# EAGLE design MurataBLE_FS (EAGLE 7.5.0)
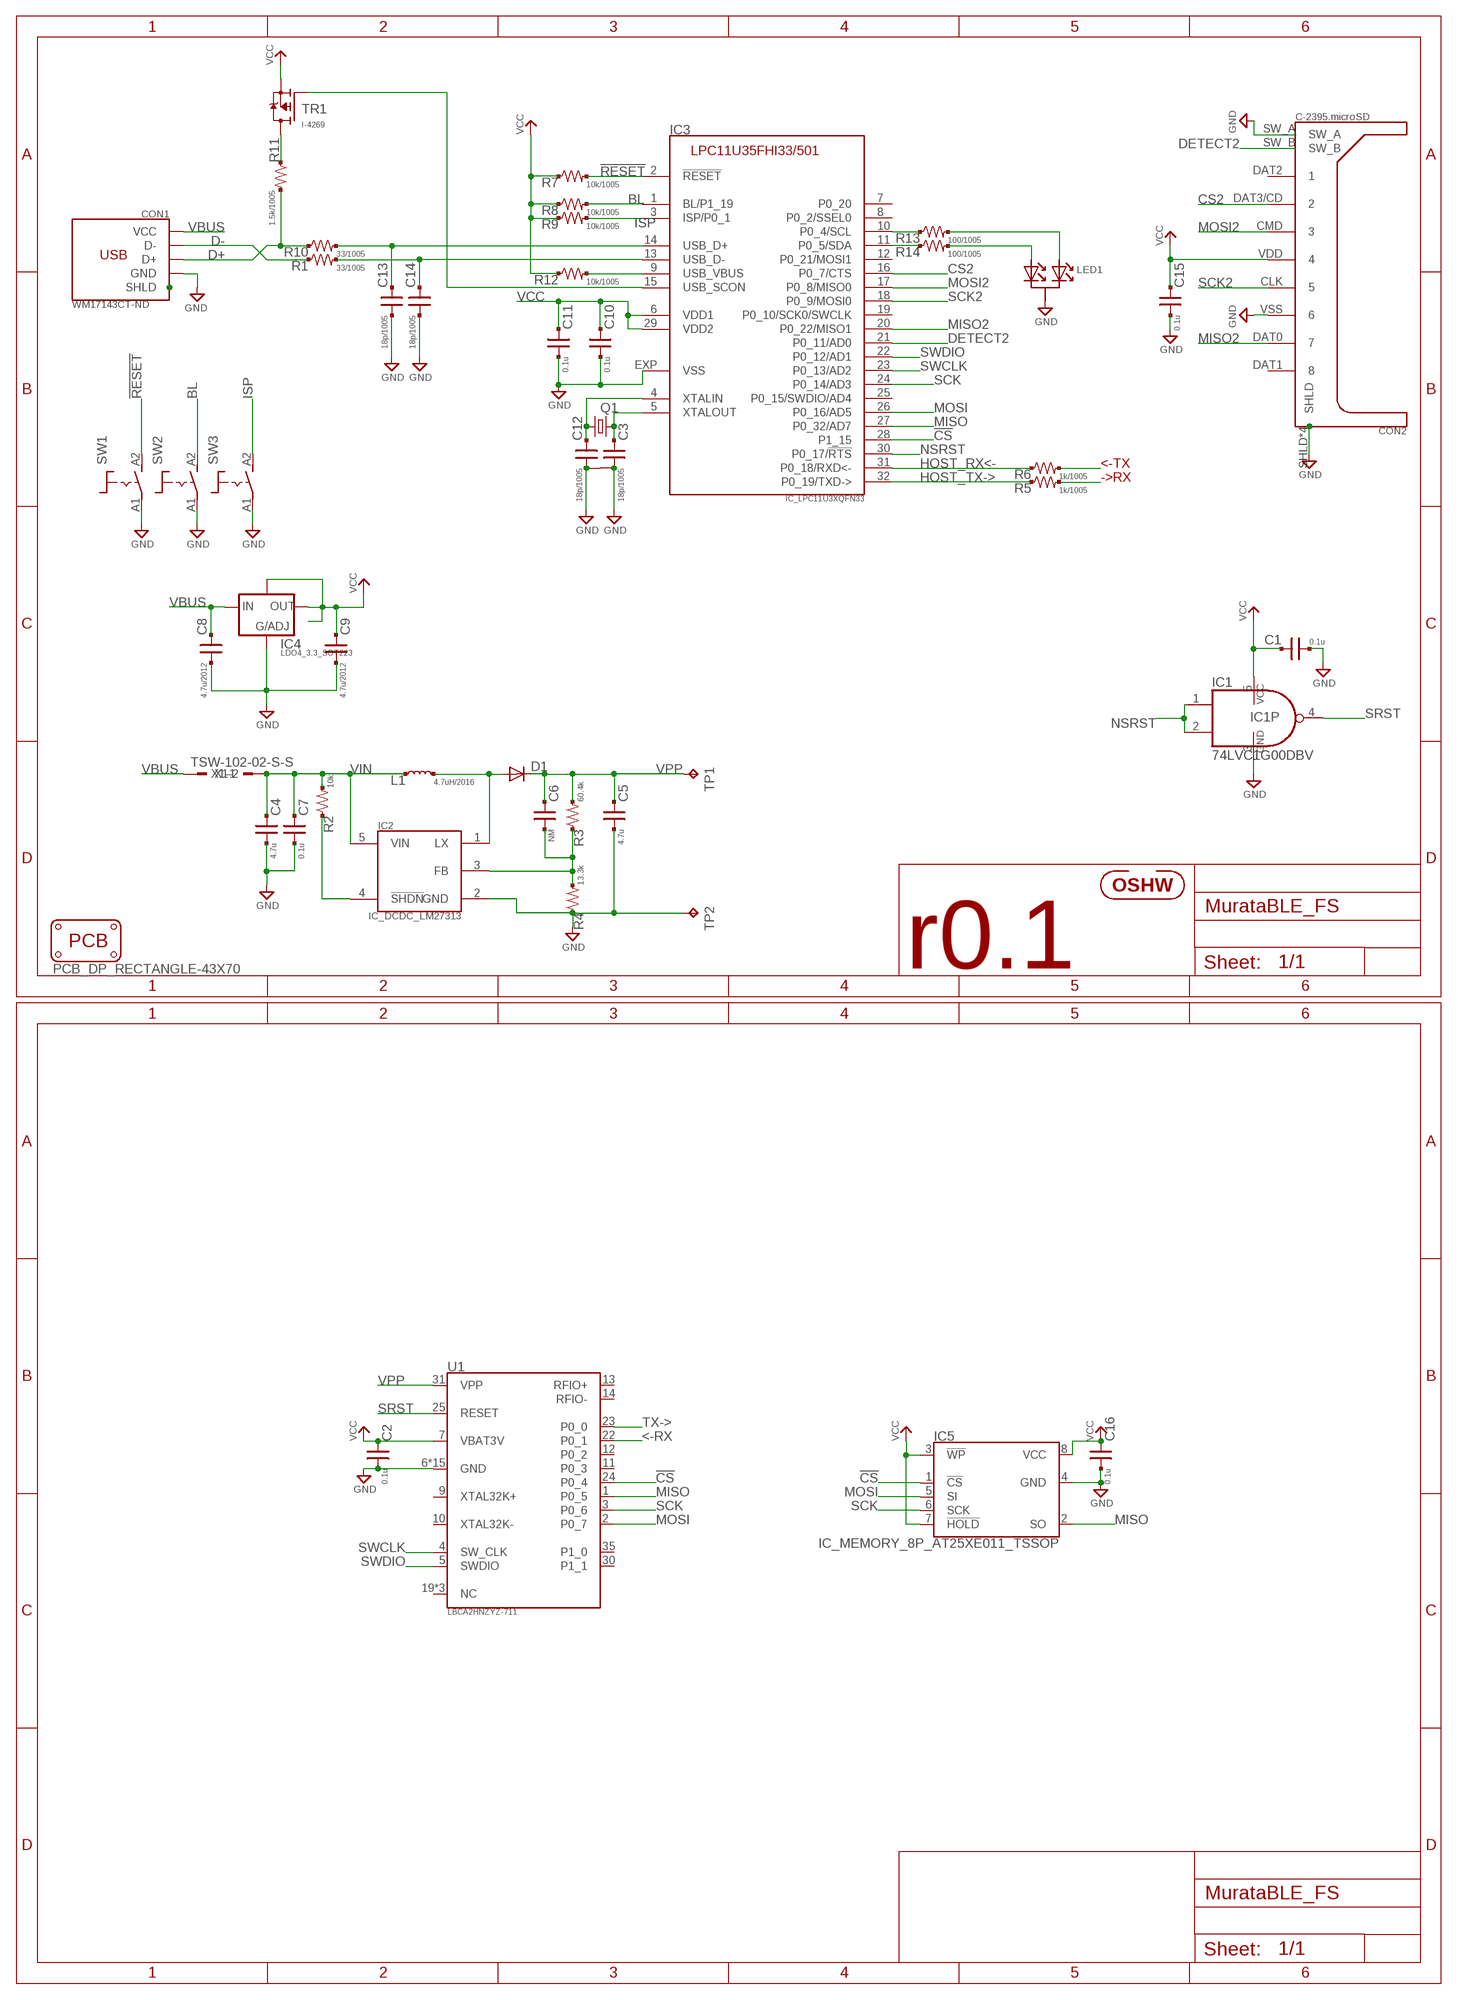
[diagram p0: schematic, sheet 1]

## Parts
C1  0.1u  C_SMD_0.1U_1005  [C0402]
C2  0.1u  C_SMD_0.1U_1005  [C0402]
C3  18p/1005  C_SMD_18P_1005  [C0402]
C4  4.7u  C_SMD_4.7U_2012  [CR_2125]
C5  4.7u  C_SMD_4.7U_2012  [CR_2125]
C6  NM  C_SMD__1608  [CR_1608]
C7  0.1u  C_SMD_0.1U_1608  [CR_1608]
C8  4.7u/2012  C_SMD_4.7U_2012  [CR_2125]
C9  4.7u/2012  C_SMD_4.7U_2012  [CR_2125]
C10  0.1u  C_SMD_0.1U_1005  [C0402]
C11  0.1u  C_SMD_0.1U_1005  [C0402]
C12  18p/1005  C_SMD_18P_1005  [C0402]
C13  18p/1005  C_SMD_18P_1005  [C0402]
C14  18p/1005  C_SMD_18P_1005  [C0402]
C15  0.1u  C_SMD_0.1U_1608  [CR_1608]
C16  0.1u  C_SMD_0.1U_1005  [C0402]
CON1  WM17143CT-ND  CON_USB_UB  [CON_USB_47589-0001MOLEX]
CON2  C-2395.microSD  CON_MICROSD_C2395  [CON_MICROSD_C2395]
D1  DIODE_SMALL  [DIODE_2125]
IC1  74LVC1G00DBV  [SOT23-5]
IC2  IC_DCDC_LM27313  [IC_05_0.95_50MIL]
IC3  IC_LPC11U3XQFN33  [HVQFN33]
IC4  LDO4_3.3_SOT223  [IC_SOT223]
IC5  IC_MEMORY_8P_AT25XE011_TSSOP  [IC_08_0.65_160MIL]
L1  4.7uH/2016  INDUCTOR_4.7U_2016  [L_2016]
LED1  LED_1SEG_A2K1  [SOT95P300X140-3N]
PCB1  PCB_DP_RECTANGLE-43X70  [DP7043_V1]
Q1  CRYSTAL4_12M_3225  [CLOCK_3225]
R1  33/1005  R_US_33R_1005  [C0402]
R2  10k  R_US_10K_1608  [R_1608_PADPAD]
R3  60.4k  R_US_60.4K_1608  [R_1608_PADPAD]
R4  13.3k  R_US_13.3K_1608  [R_1608_PADPAD]
R5  1k/1005  R_US_1.0K_1005  [C0402]
R6  1k/1005  R_US_1.0K_1005  [C0402]
R7  10k/1005  R_US_10K_1005  [C0402]
R8  10k/1005  R_US_10K_1005  [C0402]
R9  10k/1005  R_US_10K_1005  [C0402]
R10  33/1005  R_US_33R_1005  [C0402]
R11  1.5k/1005  R_US_1.5K_1005  [C0402]
R12  10k/1005  R_US_10K_1005  [C0402]
R13  100/1005  R_US_100R_1005  [C0402]
R14  100/1005  R_US_100R_1005  [C0402]
SW1  TACTSW2_BK_P807X  [SW_TACTSW_P8073]
SW2  TACTSW2_WH_P807X  [SW_TACTSW_P8073]
SW3  TACTSW2_BK_P807X  [SW_TACTSW_P8073]
TP1  P7592  TPPAD1-13  [P1-13]
TP2  P7591  TPPAD1-13  [P1-13]
TR1  I-4269  TR_PMOS_GDS_SOT23  [SOT95P300X140-3N]
U1  LBCA2HNZYZ-711  [IC_MURATA_LBCA2HNZYZ-711]
U$1  ICON_OSHW  [ICON_OSHW]
X1  TSW-102-02-S-S  [TSW-102-02-S-S]

## Nets
!CS!: IC3.28(P1_15) IC5.1(!CS) U1.24(P0_4)
!RESET!: IC3.2(!RESET!) R7.2 SW1.A2(S)
<-RX: R5.2 U1.22(P0_1)
BL: IC3.1(BL/P1_19) R8.2 SW2.A2(S)
CS2: CON2.DAT3/CD IC3.16(P0_7/CTS)
D+: CON1.3(D+) R10.1 R11.2
D-: CON1.2(D-) R1.1
DETECT2: CON2.SW_B IC3.21(P0_11/AD0)
GND: C1.2 C2.2 C3.2 C4.2 C5.2 C7.2 C8.2 C9.2 C10.2 C11.2 C12.2 C13.2 C14.2 C15.2 C16.2 CON1.5(GND) CON2.SHLD CON2.SHLD@2(SHLD) CON2.SHLD@3(SHLD) CON2.SHLD@4(SHLD) CON2.SW_A CON2.VSS IC1.3(GND) IC2.2(GND) IC3.EXP(VSS) IC4.1(ADJ) IC5.4(GND) LED1.3(K1) Q1.2 Q1.4 R4.1 SW1.A1(P) SW2.A1(P) SW3.A1(P) TP2.TP U1.6(GND) U1.8(GND) U1.15(GND) U1.16(GND) U1.17(GND) U1.18(GND) U1.20(GND) U1.21(GND) U1.26(GND) U1.27(GND) U1.28(GND) U1.29(GND) U1.32(GND) U1.33(GND) U1.34(GND)
HOST_RX<-: IC3.31(P0_18/RXD<-) R6.1
HOST_TX->: IC3.32(P0_19/TXD->) R5.1
ISP: IC3.3(ISP/P0_1) R9.2 SW3.A2(S)
MISO: IC3.27(P0_32/AD7) IC5.2(SO) U1.1(P0_5)
MISO2: CON2.DAT0 IC3.20(P0_22/MISO1)
MOSI: IC3.26(P0_16/AD5) IC5.5(SI) U1.2(P0_7)
MOSI2: CON2.CMD IC3.17(P0_8/MISO0)
N$2: R11.1 TR1.3(D)
N$3: IC3.10(P0_4/SCL) R13.1
N$4: CON1.SHD$1(SHLD) CON1.SHD$2(SHLD) CON1.SHD$3(SHLD) CON1.SHD$4(SHLD) CON1.SHD$5(SHLD) CON1.SHD$6(SHLD) CON1.SHD$7(SHLD) CON1.SHD(SHLD)
N$5: C12.1 IC3.4(XTALIN) Q1.1
N$6: IC3.11(P0_5/SDA) R14.1
N$7: D1.A IC2.1(LX) L1.2
N$8: IC2.4(!SHDN!) R2.1
N$9: LED1.2(A2) R13.2
N$10: C6.2 IC2.3(FB) R3.1 R4.2
N$11: C3.1 IC3.5(XTALOUT) Q1.3
N$12: IC3.15(USB_SCON) TR1.1(G)
N$13: IC3.9(USB_VBUS) R12.2
N$14: LED1.1(A1) R14.2
N$20: C13.1 IC3.14(USB_D+) R10.2
N$24: C14.1 IC3.13(USB_D-) R1.2
NSRST: IC1.1(I0) IC1.2(I1) IC3.30(P0_17/!RTS!)
SCK: IC3.24(P0_14/AD3) IC5.6(SCK) U1.3(P0_6)
SCK2: CON2.CLK IC3.18(P0_9/MOSI0)
SRST: IC1.4(O) U1.25(RESET)
SWCLK: IC3.23(P0_13/AD2) U1.4(SW_CLK)
SWDIO: IC3.22(P0_12/AD1) U1.5(SWDIO)
TX->: R6.2 U1.23(P0_0)
VBUS: C8.1 CON1.1(VCC) IC4.3(IN) X1.1
VCC: C1.1 C2.1 C9.1 C10.1 C11.1 C15.1 C16.1 CON2.VDD IC1.5(VCC) IC3.6(VDD1) IC3.29(VDD2) IC4.2(OUT) IC4.4(OUT/EN/NC) IC5.3(!WP) IC5.7(!HOLD) IC5.8(VCC) R7.1 R8.1 R9.1 R12.1 TR1.2(S) U1.7(VBAT3V)
VIN: C4.1 C7.1 IC2.5(VIN) L1.1 R2.2 X1.2
VPP: C5.1 C6.1 D1.K(C) R3.2 TP1.TP U1.31(VPP)
Unconnected: CON2.DAT1 CON2.DAT2 IC3.7(P0_20) IC3.8(P0_2/SSEL0) IC3.12(P0_21/MOSI1) IC3.19(P0_10/SCK0/SWCLK) IC3.25(P0_15/SWDIO/AD4) U1.9(XTAL32K+) U1.10(XTAL32K-) U1.11(P0_3) U1.12(P0_2) U1.13(RFIO+) U1.14(RFIO-) U1.19(NC) U1.30(P1_1) U1.35(P1_0) U1.36(NC) U1.37(NC)

## Notes on the sheet
- <-TX
- ->RX
- r0.1

## Library data of the parts
C1 C2 C10 C11 C16 = mylib:C_SMD_*: SMD CAPACITOR : PAD - PAD; DIGIKEY: 490-3261-1-ND
C3 C12-C14 = mylib:C_SMD_*: SMD CAPACITOR : PAD - PAD; DIGIKEY: 490-5858-1-ND
C4 C5 C8 C9 = mylib:C_SMD_*: SMD CAPACITOR : PAD - PAD; DIGIKEY: 490-9962-1-ND
C6 = mylib:C_SMD_*: SMD CAPACITOR : PAD - PAD
C7 C15 = mylib:C_SMD_*: SMD CAPACITOR : PAD - PAD; AKIZUKI: P-05650
CON1 = mylib:CON_USB: USB B CONNECTOR; DIGIKEY: WM17143CT-ND
CON2 = mylib:CON_MICROSD: HIROSE DM3AT-SF-PEJM5 798-DM3AT-SF-PEJM5(Mouser) http://www.mouser.jp/ProductDetail/Hirose-Connector/DM3AT-SF-PEJM5/?qs=LZSZKJVF%252b2WTDKp%252bR7IYAQ%3d%3d&_cdc=0; AKIZUKI: C-02395; DIGIKEY: HR1964CT-ND; MOUSER: 798-DM3AT-SF-PEJM5
D1 = mylib:DIODE_SMALL: DIODE high speed (Philips)
IC1 = 74xx-little-us_local:74*1G00: 2-input NAND gate
IC2 = mylib:IC_DCDC_LM27313
IC3 = mylib:IC_LPC11U3XQFN33
IC4 = mylib:LDO4_*; DIGIKEY: AZ1117EH-3.3TRG1DICT-ND
IC5 = mylib:IC_MEMORY_8P_*; DIGIKEY: 1265-1184-5-ND; MOUSER: !non-stock! 988-AT25XE011-SSHN-B
L1 = mylib:INDUCTOR_; DIGIKEY: 445-7844-1-ND
LED1 = mylib:LED_1SEG_A2K1
PCB1 = dp_pcb_local:PCB_DP_RECTANGLE: Dangerous Prototypes Standard Rectangular PCB sizes
Q1 = mylib:CRYSTAL4_*; DIGIKEY: 1253-1168-1-ND
R1 R10 = mylib:R_US_*: R_US_PAD_PAD : SMD R PAD is NTH-NTH Packages : _1608 : 1.6 x 0.8 mm _2125 : 2.0 x 1.25 mm _3216 : 3.2 x 1.6 mm; DIGIKEY: P33.0LCT-ND
R2 R5 R6 = mylib:R_US_*: R_US_PAD_PAD : SMD R PAD is NTH-NTH Packages : _1608 : 1.6 x 0.8 mm _2125 : 2.0 x 1.25 mm _3216 : 3.2 x 1.6 mm
R3 = mylib:R_US_*: R_US_PAD_PAD : SMD R PAD is NTH-NTH Packages : _1608 : 1.6 x 0.8 mm _2125 : 2.0 x 1.25 mm _3216 : 3.2 x 1.6 mm; DIGIKEY: P60.4KHCT-ND
R4 = mylib:R_US_*: R_US_PAD_PAD : SMD R PAD is NTH-NTH Packages : _1608 : 1.6 x 0.8 mm _2125 : 2.0 x 1.25 mm _3216 : 3.2 x 1.6 mm; DIGIKEY: P13.3KHCT-ND
R7-R9 R12 = mylib:R_US_*: R_US_PAD_PAD : SMD R PAD is NTH-NTH Packages : _1608 : 1.6 x 0.8 mm _2125 : 2.0 x 1.25 mm _3216 : 3.2 x 1.6 mm; DIGIKEY: P10.0KLCT-ND
R11 = mylib:R_US_*: R_US_PAD_PAD : SMD R PAD is NTH-NTH Packages : _1608 : 1.6 x 0.8 mm _2125 : 2.0 x 1.25 mm _3216 : 3.2 x 1.6 mm; DIGIKEY: P1.50KLCT-ND
R13 R14 = mylib:R_US_*: R_US_PAD_PAD : SMD R PAD is NTH-NTH Packages : _1608 : 1.6 x 0.8 mm _2125 : 2.0 x 1.25 mm _3216 : 3.2 x 1.6 mm; DIGIKEY: P100LCT-ND
SW1 SW3 = mylib:TACTSW2_*; AKIZUKI: P-08073
SW2 = mylib:TACTSW2_*; AKIZUKI: P-08074
TP1 TP2 = testpad_local:TP: Test pad
TR1 = mylib:TR_PMOS_GDS
U1 = mylib:LBCA2HNZYZ-711; DIGIKEY: 490-10561-1-ND; MOUSER: 81-LBCA2HNZYZ-711
U$1 = mylib:ICON_OSHW
X1 = con-samtec.local:TSW-102-02-S-S: THROUGH-HOLE .025" SQ POST HEADER Source: Samtec TSW.pdf; OC_FARNELL: unknown; OC_NEWARK: unknown

## Board
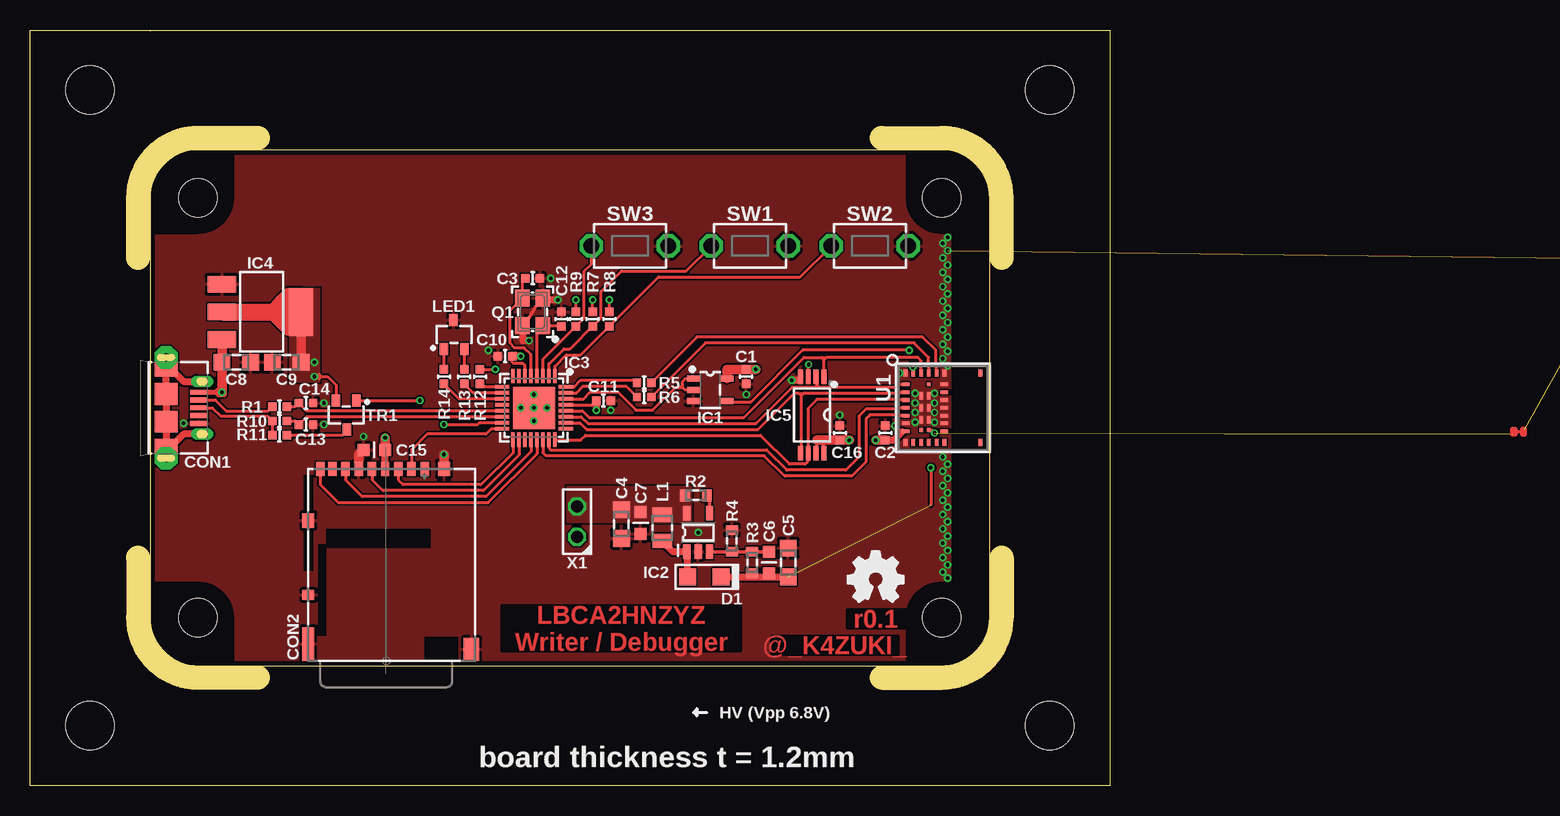
[diagram p1: board, top side]
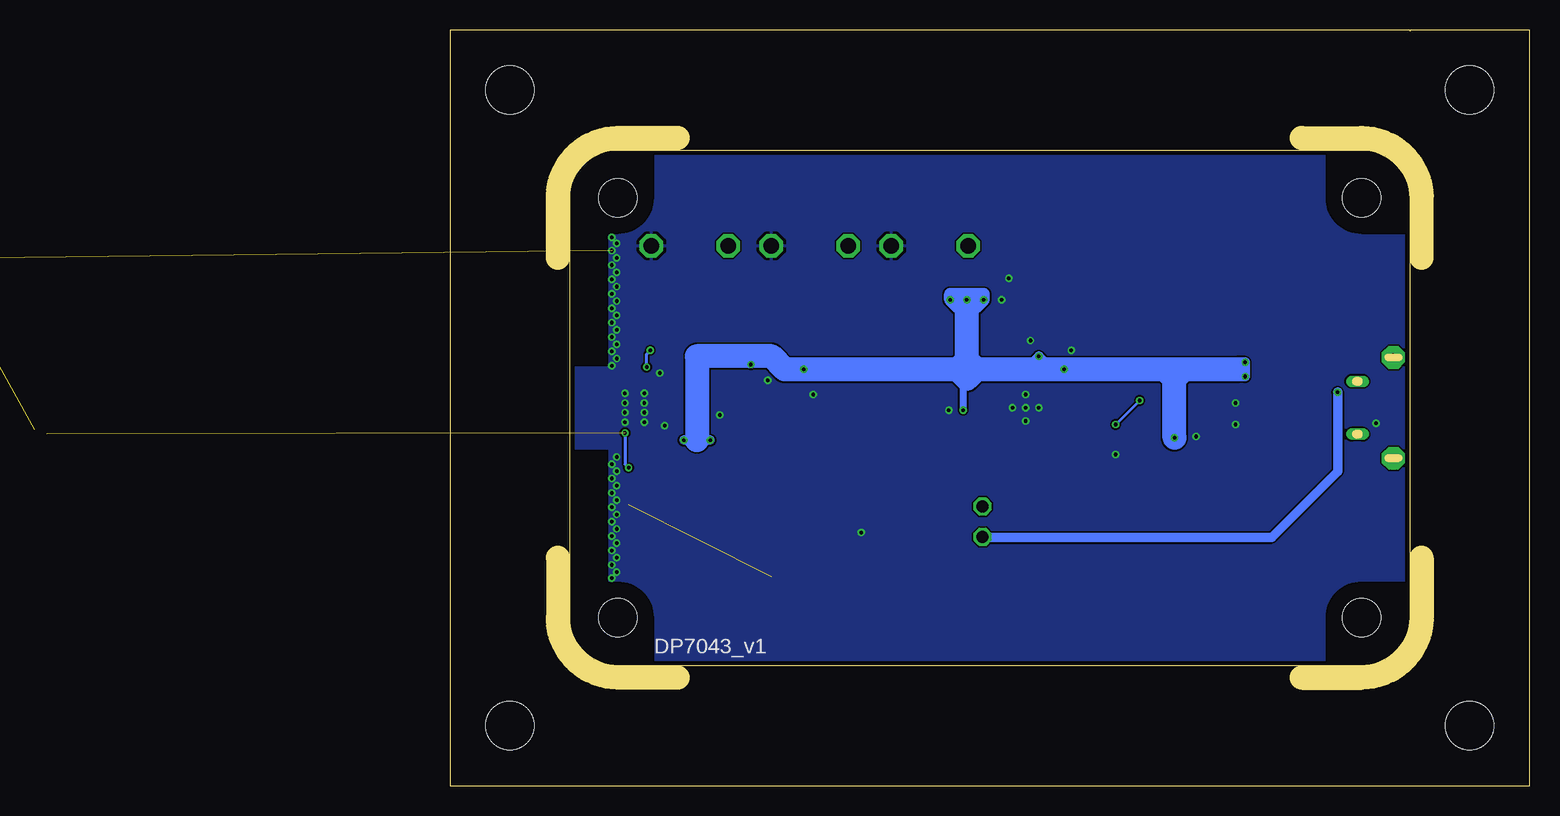
[diagram p2: board, bottom side, seen from below]

Size 90 x 63 mm. Coordinates in mm from the lower left corner, seen from the top.
Outline: 10,63 90,63 90,0 0,0 0,63 10,63
Outline: 10,63 10,62.9
Copper layers (1*16): Top 0.035mm / dielectric 1.5mm / Bottom 0.035mm
Design rules "default *": minimum track width 0.15mm, minimum drill 0.3mm, track to track 0.15mm, track to pad 0.15mm, pad to pad 0.15mm, via to via 0.15mm, smd to smd 0mil, copper to edge 0.4mm, drill to drill 8mil, minimum pad ring 0.15mm, minimum via ring 0.15mm, stop-mask expansion 4mil, vias tented up to drill 100mil, thermal gap 10mil
Holes 4 mm at 5,58 5,5 85,5 85,58
tRestrict: area 40.4,37.6 to 41.7,39.1; area 76.8,35 to 80,53; area 76.8,10 to 80,28
bRestrict: area 76.8,35 to 80,53; area 76.8,10 to 80,28
Milling: 12 lines

### Footprints (pad centres in the part's own frame; a part is rotated, then mirrored left to right if it is on the bottom)
C0402 = smd 0.7 x 0.7: 1 -0.6,0; 2 0.6,0
CR_2125 = smd 1.4 x 1.4: 1 -1.2,0; 2 1.2,0
CR_1608 = smd 1 x 1: 1 -0.9,0; 2 0.9,0
CON_USB_47589-0001MOLEX = smd 0.4 x 1.4: 1 -1.3,4.15; 2 -0.65,4.15; 3 0,4.15; 4 0.65,4.15; 5 1.3,4.15 | drill 0.6 pad 0.95 long: SHD -2.2,4.45; SHD$1 2.2,4.45 | drill 0.6 pad 1.9 octagon: SHD$2 -4.2,1.45; SHD$3 4.2,1.45 | smd 1.6 x 1.9: SHD$4 -3.4,1.45; SHD$7 3.4,1.45 | smd 1.8 x 1.9: SHD$5 -1.15,1.45; SHD$6 1.15,1.45
CON_MICROSD_C2395 = smd 0.7 x 1.2: CLK -1.2,16; CMD 1,16; DAT0 -3.4,16; DAT1 -4.5,16; DAT2 3.2,16; DAT3/CD 2.1,16; SW_B -5.5,16; VDD -0.1,16; VSS -2.3,16 | smd 1 x 1.2: SHLD -6.5,11.7; SHLD@4 4.8,16 | smd 1 x 2.8: SHLD@2 -6.5,1.4 | smd 1.3 x 1.9: SHLD@3 7.1,0.95 | smd 1 x 0.8: SW_A -6.5,5.5
DIODE_2125 = smd 1.4 x 1.4: A 1.4,0; K -1.4,0
SOT23-5 = smd 0.5 x 1.1: 1 -0.95,-1.4; 2 0,-1.4; 3 0.95,-1.4; 4 0.95,1.4; 5 -0.95,1.4
IC_05_0.95_50MIL = smd 0.6 x 1.2: 1 -0.95,-1.6; 2 0,-1.6; 3 0.95,-1.6; 4 0.95,1.6; 5 -0.95,1.6
HVQFN33 = smd 1.2 x 0.3: 1 -2.65,1.75; 2 -2.65,1.25; 3 -2.65,0.75; 4 -2.65,0.25; 5 -2.65,-0.25; 6 -2.65,-0.75; 7 -2.65,-1.25; 8 -2.65,-1.75; 17 2.65,-1.75; 18 2.65,-1.25; 19 2.65,-0.75; 20 2.65,-0.25; 21 2.65,0.25; 22 2.65,0.75; 23 2.65,1.25; 24 2.65,1.75 | smd 0.3 x 1.2: 9 -1.75,-2.65; 10 -1.25,-2.65; 11 -0.75,-2.65; 12 -0.25,-2.65; 13 0.25,-2.65; 14 0.75,-2.65; 15 1.25,-2.65; 16 1.75,-2.65; 25 1.75,2.65; 26 1.25,2.65; 27 0.75,2.65; 28 0.25,2.65; 29 -0.25,2.65; 30 -0.75,2.65; 31 -1.25,2.65; 32 -1.75,2.65 | smd 3.5 x 3.5: EXP 0,0
IC_SOT223 = smd 1.4 x 2.4: 1 -2.3,-3.3; 2 0,-3.3; 3 2.3,-3.3 | smd 4 x 2: 4 0,3.3
IC_08_0.65_160MIL = smd 0.4 x 1.2: 1 -0.975,-3.2; 2 -0.325,-3.2; 3 0.325,-3.2; 4 0.975,-3.2; 5 0.975,3.2; 6 0.325,3.2; 7 -0.325,3.2; 8 -0.975,3.2
L_2016 = smd 1.2 x 1.6: 1 -1.1,0; 2 1.1,0
SOT95P300X140-3N = smd 0.7 x 1: 1 -0.8,-1.2; 2 0.9,-1.2; 3 0,1.2
DP7043_V1 = hole 3.2: 4,4; 66,4; 66,39; 4,39
CLOCK_3225 = smd 1.4 x 1.2: 1 -1.15,-0.85; 2 1.15,-0.85; 3 1.15,0.85; 4 -1.15,0.85
R_1608_PADPAD = smd 0.8 x 1: 1 -0.9,0; 2 0.9,0
SW_TACTSW_P8073 = drill 1.3 octagon: A1 -3.2,0; A2 3.2,0
P1-13 = drill 1.321 pad 2.159 octagon: TP 0,0
IC_MURATA_LBCA2HNZYZ-711 = smd 0.3 x 0.6: 1 1.55,0.6; 2 2.2,0.6; 3 2.85,0.6; 4 3.5,0.6; 5 4.15,0.6; 6 4.8,0.6; 7 5.45,0.6; 14 5.45,3.8; 15 4.8,3.8; 16 4.15,3.8; 17 3.5,3.8; 18 2.85,3.8; 19 2.2,3.8; 20 1.55,3.8 | smd 0.6 x 0.3: 8 6.4,0.575; 9 6.4,1.225; 10 6.4,1.875; 11 6.4,2.525; 12 6.4,3.175; 13 6.4,3.825; 21 0.6,3.825; 22 0.6,3.175; 23 0.6,2.525; 24 0.6,1.875; 25 0.6,1.225; 26 0.6,0.575; 27 2.5,1.875; 28 3.5,1.875; 29 4.5,1.875; 32 4.5,2.525; 33 3.5,2.525; 34 2.5,2.525; 36 6.4,6.825; 37 0.6,6.825 | smd 0.3 x 0.3: 30 5.35,1.875; 31 5.35,2.525; 35 1.55,2.525
TSW-102-02-S-S = drill 1 pad 1.5 octagon: 1 1.27,0; 2 -1.27,0

### Placement (x,y rotation side)
C1  59.7,34.1 270 top
C2  71.3,29.4 90 top
C3  41.9,42.3 0 top
C4  49.3,21.8 270 top
C5  63.2,18.6 90 top
C6  61.6,18.6 90 top
C7  50.9,21.9 270 top
C8  17.2,35.3 0 top
C9  21.4,35.3 180 top
C10  39.6,35.8 180 top
C11  47.8,32.1 0 top
C12  44.3,38.9 90 top
C13  23,30.1 0 top
C14  23,31.9 0 top
C15  28.7,28 180 top
C16  67.5,29.4 90 top
CON1  9.9,31.5 270 top
CON2  29.7,10.4 0 top
D1  56.2,17.4 180 top
IC1  56.7,33 270 top
IC2  55.7,21.1 0 top
IC3  42,31.5 270 top
IC4  19.3,39.5 270 top
IC5  65.2,30.9 180 top
L1  52.7,21.5 270 top
LED1  35.3,37.6 0 top
PCB1  10,10 0 top
Q1  41.9,39.5 90 top
R1  20.8,31.6 0 top
R2  55.5,24.2 180 top
R3  60.2,18.6 270 top
R4  58.5,20.4 270 top
R5  51.2,33.6 0 top
R6  51.2,32.4 0 top
R7  46.9,38.9 270 top
R8  48.3,38.9 270 top
R9  45.5,38.9 270 top
R10  20.8,30.4 0 top
R11  20.8,29.2 180 top
R12  37.5,34.1 270 top
R13  36.2,34.1 90 top
R14  34.5,34.1 90 top
SW1  60,45 180 top
SW2  70,45 180 top
SW3  50,45 180 top
TP1  132.5,43.9 180 top  (outside the outline)
TP2  136,43.9 180 top  (outside the outline)
TR1  26.4,30.9 180 top
U1  72.4,35 270 top
U$1  70.5,17.2 0 top
X1  45.6,22 270 top

### Tracks (layer width: path | path; a pad name or v marks a point on that pad's centre or on a via)
!CS!
  Top 0.25: U1.24 74.28,35.42 74,35.7 66.4,35.7 | 66.4,35.7 66.2,35.5 | IC5.1 66.2,34.4 66.2,35.5 | IC3.28 46.05,31.25 46.6,30.7 59.5,30.7 64.5,35.7 66,35.7 | 66,35.7 66.2,35.5 | 66,35.7 66.4,35.7
!RESET!
  Top 0.25: IC3.2 43.25,35.15 44.5,36.4 45,36.4 R7.2 47.6,39 47.6,41.2 49.3,42.9 54.7,42.9 SW1.A2
<-RX
  Top 0.25: R5.2 55.6,37.4 74.4,37.4 75.5,36.3 75.5,35 75.58,34.92 U1.22
BL
  Top 0.25: IC3.1 43.75,34.95 44.7,35.9 45.9,35.9 R8.2 52.4,42.4 64.2,42.4 SW2.A2
CS2
  Top 0.25: IC3.16 38.45,29.75 38,29.3 33.1,29.3 31.8,28 CON2.DAT3/CD
D+
  Top 0.25: CON1.3 15.2,31.5 15.9,30.8 19.8,30.8 R10.1 R11.2
D-
  Top 0.25: CON1.2 15.45,32.15 16.4,31.2 19.8,31.2 R1.1
DETECT2
  Top 0.25: CON2.SW_B 24.2,25.1 25.7,23.6 38.2,23.6 42.25,27.65 IC3.21
GND  (via drill 0.3)  (1 unrouted)
  Top 0.25: Q1.2 42.75,40.55 42.2,40 41.6,39 41.05,38.45 Q1.4
  Top 0.6: CON2.VSS 27.4,27 | v41.6,37.1 41.1,37.1 41.1,38.3 41,38.3 | v44,40.5 42.8,40.5 | v63.5,33.8 64.1,33.8
  Top 0.8: 27.4,27 27.4,27.6 C15.2 | v34.5,27.6 CON2.SHLD@4
  other vias: 42,31.5 40.9,31.5 43.1,31.5 42,32.6 42,30.4 24.5,30.1 24.5,31.9 43.4,42.3 38.2,36.3 48.4,31.3 27.8,29.1 12.8,30.2 75.4,31.9 75.4,31.1 73.8,31.9 73.8,31.1 72.1,30 67.5,30.9 59.7,32.6 72.5,34.4 73.8,30.3 75.4,30.3 73.8,32.7 75.4,32.7 76.5,35 76.5,36.2 76.1,35.6 76.1,36.8 76.5,37.4 76.1,38 76.5,38.6 76.1,39.2 76.5,39.8 76.1,40.4 76.5,41 76.1,41.6 76.5,42.2 76.1,42.8 76.5,43.4 76.1,44 76.5,44.6 76.1,45.2 76.5,45.7 76.1,27.4 76.5,26.8 76.1,26.2 76.5,25.6 76.1,25 76.5,24.4 76.1,23.8 76.5,23.2 76.1,22.6 76.5,22 76.1,21.4 76.5,20.8 76.1,20.2 76.5,19.6 76.1,19 76.5,18.4 76.1,17.8 76.5,17.3 55.7,21.1
  pour Top (rank 2): 10,53 80,53 80,10 10,10
  pour Bottom: 10,53 80,53 80,10 10,10
  pour Top (no thermals): 72.4,35 76.8,35 76.8,27.9 72.3,27.9
HOST_RX<-
  Top 0.25: IC3.31 45.55,32.75 46.1,33.3 49.7,33.3 R6.1
HOST_TX->
  Top 0.25: IC3.32 45.35,33.25 45.9,33.8 50.4,33.8 R5.1
ISP
  Top 0.25: IC3.3 42.75,35.55 R9.2 46.2,39 46.2,42.9 46.8,43.5 SW3.A2
MISO
  Top 0.25: IC5.2 65.53,34.38 65.6,34.3 65.6,33.4 | IC3.27 45.95,30.75 46.5,30.2 60.5,30.2 63.5,33.2 65.4,33.2 | U1.1 72.45,33.45 72.2,33.2 65.8,33.2 | 65.8,33.2 65.6,33.4 | 65.6,33.4 65.4,33.2 | 65.4,33.2 65.8,33.2
MISO2
  Top 0.25: CON2.DAT0 26.3,25.5 27.7,24.1 38,24.1 41.75,27.85 IC3.20
MOSI
  Top 0.25: U1.2 72.6,32.8 72.5,32.7 64.5,32.7 | 64.5,32.7 64.3,32.5 | IC5.5 64.22,28.12 64.3,28.2 64.3,32.5 | IC3.26 45.85,30.25 46.4,29.7 60.7,29.7 63.7,32.7 64.1,32.7 | 64.3,32.5 64.1,32.7 | 64.1,32.7 64.5,32.7
MOSI2
  Top 0.25: IC3.17 40.25,27.75 37.6,25.1 31.1,25.1 30.7,25.5 CON2.CMD
N$2
  Top 0.25: TR1.3 26.4,29.6 26,29.2 R11.1
N$3
  Top 0.25: IC3.10 36.95,32.75 R13.1
N$4
  Top 0.6: CON1.SHD$2 CON1.SHD$4 | CON1.SHD$7 CON1.SHD$6 CON1.SHD$5 CON1.SHD$4 | CON1.SHD$3 CON1.SHD$7 | CON1.SHD$4 11.6,34.9 12.8,33.7 CON1.SHD | CON1.SHD$1 12.8,29.3 11.6,28.1 CON1.SHD$7
N$5
  Top 0.25: C12.1 44.25,38.35 Q1.1 42.25,37.85 IC3.4
N$6
  Top 0.25: IC3.11 35.75,32.25 R14.1
N$7
  Top 0.6: L1.2 53.6,19.5 IC2.1 54.75,17.45 D1.A
N$8
  Top 0.3: IC2.4 56.65,23.95 R2.1
N$9
  Top 0.25: LED1.2 R13.2
N$10
  Top 0.3: IC2.3 R4.2 R3.1 C6.2
N$11
  Top 0.25: IC3.5 41.75,35.95 41.2,36.5 40.4,36.5 40,36.9 40,39.6 Q1.3 41.05,42.05 C3.1
N$12  (via drill 0.3)
  Top 0.25: IC3.15 37.45,30.25 37.3,30.1 v34.5,30.1 | TR1.1 v32.5,32.1
  Bottom 0.25: v32.5,32.1 v34.5,30.1
N$13
  Top 0.25: IC3.9 37.75,33.25 R12.2
N$14
  Top 0.25: R14.2 LED1.1
N$20
  Top 0.25: IC3.14 23.05,30.75 C13.1 22.1,30.4 R10.2
N$24
  Top 0.25: IC3.13 23.05,31.25 C14.1 22.1,31.6 R1.2
NSRST
  Top 0.25: IC3.30 46.15,32.25 46.7,32.8 49,32.8 50.5,31.3 51.9,31.3 53.8,33.2 54.2,33.2 | IC1.1 55.25,33.95 55.2,33.9 54.6,33.9 54.4,33.7 54.4,33.4 | IC1.2 54.6,33 54.4,33.2 | 54.4,33.2 54.4,33.4 | 54.2,33.2 54.4,33.2 | 54.4,33.4 54.2,33.2
SCK
  Top 0.25: U1.3 72.55,32.15 72.5,32.2 65.6,32.2 64.9,31.5 64.9,28.1 64.88,28.07 IC5.6 64.88,27.68 64.8,27.6 64.8,27 64.6,26.8 63.3,26.8 60.9,29.2 46.3,29.2 45.9,28.8 43.8,28.8 IC3.24
SCK2
  Top 0.25: IC3.18 40.75,27.55 37.8,24.6 29.4,24.6 28.5,25.5 CON2.CLK
SRST  (via drill 0.3)
  Top 0.25: U1.25 73.62,34.88 v73.6,34.9 | v73.3,36.3 64.4,36.3 60.1,32 58.2,32 58.15,32.05 IC1.4
  Bottom 0.25: v73.6,34.9 73.6,36 v73.3,36.3
SWCLK
  Top 0.25: U1.4 72.5,31.5 72.4,31.4 69.7,31.4 69.1,30.8 69.1,27.4 68,26.3 63.1,26.3 61.4,28 43.4,28 43.25,28.15 IC3.23
SWDIO
  Top 0.25: U1.5 72.55,30.85 72.5,30.9 70,30.9 69.7,30.6 69.7,27 68.5,25.8 62.9,25.8 61.2,27.5 43,27.5 42.75,27.75 IC3.22
TX->
  Top 0.25: R6.2 56.3,36.9 73.7,36.9 74.9,35.7 74.9,34.9 74.92,34.88 U1.23
VBUS  (via drill 0.3)
  Top 0.4: CON1.1 15.5,32.8 | 15.5,32.8 v16,32.8 | 15.5,32.8 15.7,32.6 16,32.6 | 16,32.6 v16,32.8 | 15.5,32.8 15.7,33 16,33 | 16,33 16.2,33 16.2,32.6 16,32.6 | 16,33 v16,32.8
  Top 0.8: IC4.3 C8.1 v16,32.8
  Bottom 0.8: v16,32.8 16,26.2 21.5,20.7 45.6,20.7 X1.1
VCC  (via drill 0.3)
  Top 0.25: IC3.6 41.25,35.05 41.1,35.2 40.3,35.2 40.2,35.3 C10.1 | IC3.29 46.85,31.75 C11.1 | R12.1 v38.8,34.7 | R9.1 v45.5,40.5 | R8.1 v48.3,40.5 | R7.1 v46.9,40.5 | IC5.7 65.53,28.32 65.6,28.4 65.6,28.8 | IC5.8 66.17,28.32 66.1,28.4 66.1,28.8 | U1.7 72.75,29.55 72.7,29.5 | IC5.3 64.88,34.17 64.9,34.2 v64.9,35.1 | v23.7,34.1 24.3,34.1 | 24.3,34.1 24.8,34.1 25.5,33.4 TR1.2 | 24.3,34.1 24.1,34.3 24.1,33.9 24.3,34.1
  Top 0.6: v40.9,35.8 C10.1 | C11.1 v47.2,31.3 | CON2.VDD C15.1 | C2.1 72,28.8 72.7,29.5
  Top 0.8: C15.1 v29.6,29 | C2.1 v70.5,28.8 | v68.3,28.8 C16.1 66.1,28.8 65.6,28.8 | v60.5,34.7 C1.1 58.1,34.7 IC1.5 | 22.6,38.2 C9.1
  Top 1.4: IC4.2 20.3,39.5 | 20.3,39.5 20.8,40 | 20.8,40 21.2,40.4 | 21.2,40.4 21.6,40.8 22.6,40.8 IC4.4 22.6,38.2 21.6,38.2 21.2,38.6 | 21.2,38.6 20.8,39 | 20.8,39 20.3,39.5 | 21.2,40.4 21.2,38.6 | 20.8,40 20.8,39
  Bottom 0.6: v64.9,35.1 64.9,35.8 | v47.2,31.3 47.2,33.6 46.9,33.9
  Bottom 0.8: v23.7,34.1 v23.7,35.3 | v23.7,35.3 24.4,34.7 v23.7,34.1 | v40.9,35.8 40.9,34.7 | 46.9,39.8 v46.9,40.5 | v40.9,35.8 41.4,35.3 40.4,35.3 v40.9,35.8 | v23.7,35.3 24.4,35.3 | v23.7,34.1 24.4,34.1 | v68.3,28.8 69.4,28.8 v70.5,28.8
  Bottom 1: v45.5,40.5 46.2,40.5 | v48.3,40.5 47.6,40.5 | v45.5,40.5 46.9,39.1 v48.3,40.5 | v45.5,40.5 45.5,41 48.3,41 v48.3,40.5
  Bottom 2: 24.4,34.7 28.8,34.7 | 28.8,34.7 29.6,34.7 | 29.6,34.7 30.4,34.7 | 30.4,34.7 v38.8,34.7 40.9,34.7 46.1,34.7 | 46.1,34.7 46.9,34.7 | 46.9,34.7 46.9,33.9 | 46.9,34.7 46.9,35.5 | 46.9,35.5 46.9,39.1 46.9,39.8 | 46.1,34.7 46.9,33.9 | 46.1,34.7 46.9,35.5 | 46.9,34.7 47.7,34.7 | 47.7,34.7 v60.5,34.7 62.1,34.7 63.2,35.8 64.9,35.8 69.4,35.8 69.4,28.8 | 46.9,35.5 47.7,34.7 | 47.7,34.7 46.9,33.9 | v29.6,29 29.6,33.9 | 29.6,33.9 29.6,34.7 | 28.8,34.7 29.6,33.9 | 29.6,33.9 30.4,34.7 | 46.9,39.8 46.2,40.5 v46.9,40.5 47.6,40.5 46.9,39.8
  pour Top (no thermals): 21.7,33.7 21.7,41.4 24.1,41.4 24.1,33.7
VIN
  pour Top (no thermals): 44.8,22 44.8,24.9 55.1,24.9 55.1,22
VPP  (via drill 0.3)  (3 unrouted)
  Top 0.25: v75.1,26.5 75.1,23.4 | 124.6,29.5 123.6,29.5 | U1.31 75.15,29.65 v75.4,29.4
  Top 0.4: 75.35,29.45 v75.4,29.4 | 123.6,29.5 123.6,29.7 123.8,29.7 123.8,29.3 123.6,29.3 123.6,29.5 | 124.6,29.5 124.6,29.7 124.4,29.7 124.4,29.3 124.6,29.3 124.6,29.5
  Top 0.6: D1.K 60.2,17.4 | 60.2,17.4 61.6,17.4 | 61.6,17.4 C5.1 | R3.2 60.2,17.4 | C6.1 61.6,17.4
  Bottom 0.25: v75.4,29.4 75.4,26.8 v75.1,26.5

### Text on the board
Top: r0.1 | LBCA2HNZYZ / Writer / Debugger | @_K4ZUKI_
tPlace: HV (Vpp 6.8V) | board thickness t = 1.2mm
Vscore: V-CUT | V-CUT | V-CUT | V-CUT